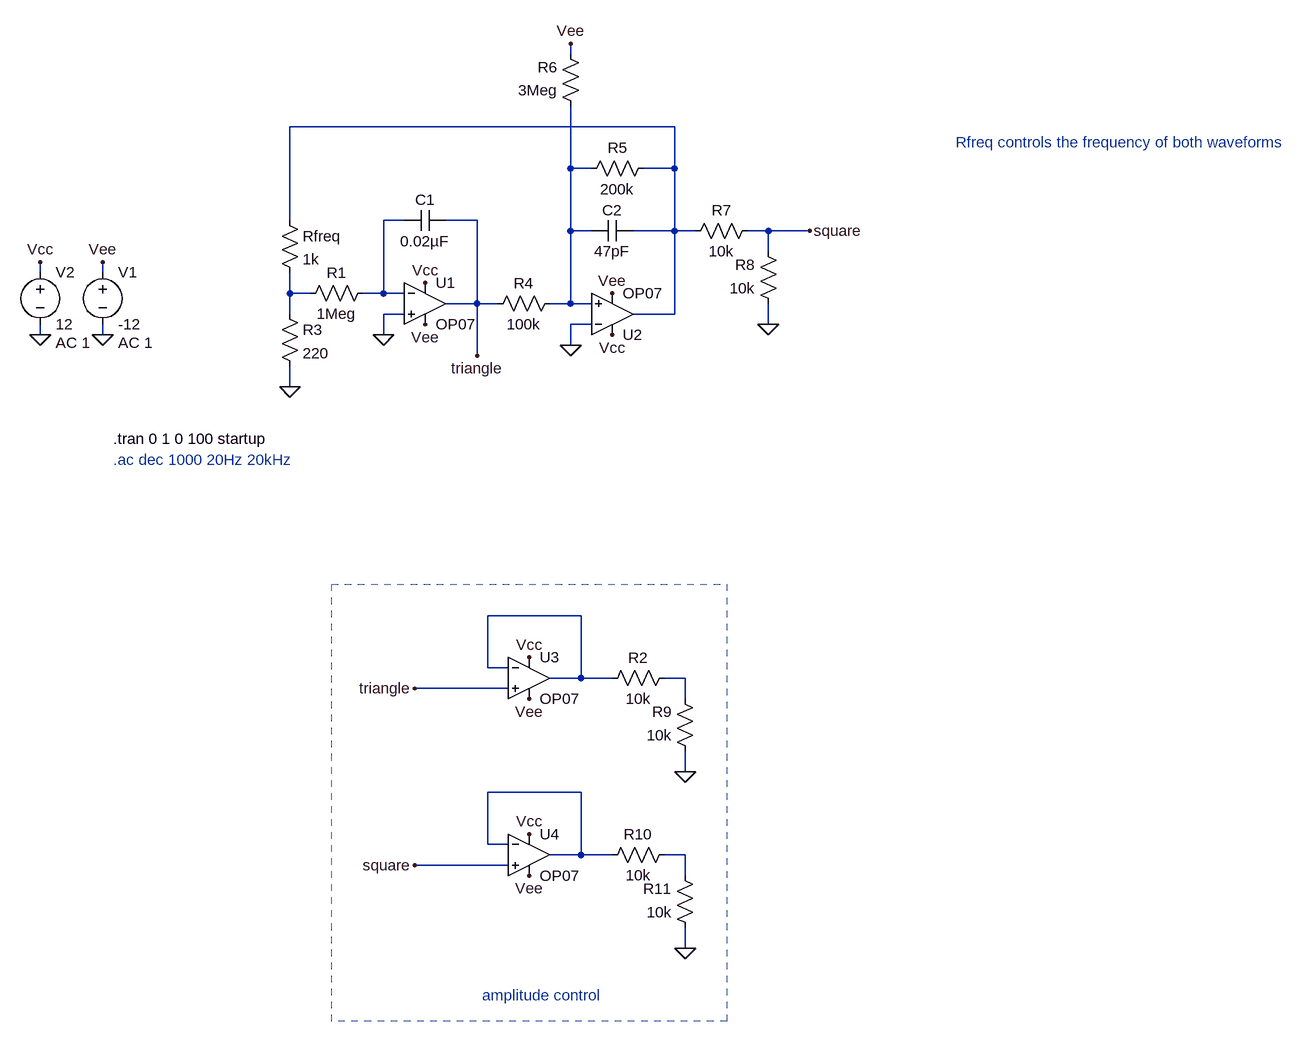
[diagram p0: schematic Draft1.asc]
Draft1.asc, the LTspice schematic file:
Version 4
SHEET 1 1568 1332
WIRE 416 -224 416 -240
WIRE 576 -112 -16 -112
WIRE 416 -48 416 -144
WIRE 448 -48 416 -48
WIRE 576 -48 576 -112
WIRE 576 -48 528 -48
WIRE -16 32 -16 -112
WIRE 160 32 128 32
WIRE 272 32 224 32
WIRE 416 48 416 -48
WIRE 448 48 416 48
WIRE 576 48 576 -48
WIRE 576 48 512 48
WIRE 608 48 576 48
WIRE 720 48 688 48
WIRE 784 48 720 48
WIRE 720 80 720 48
WIRE -400 112 -400 96
WIRE -304 112 -304 96
WIRE -16 144 -16 112
WIRE 16 144 -16 144
WIRE 128 144 128 32
WIRE 128 144 96 144
WIRE 160 144 128 144
WIRE 272 160 272 32
WIRE 272 160 224 160
WIRE 304 160 272 160
WIRE 416 160 416 48
WIRE 416 160 384 160
WIRE 448 160 416 160
WIRE -16 176 -16 144
WIRE 160 176 128 176
WIRE 576 176 576 48
WIRE 576 176 512 176
WIRE 448 192 416 192
WIRE 720 192 720 160
WIRE -400 208 -400 192
WIRE -304 208 -304 192
WIRE 128 208 128 176
WIRE 416 224 416 192
WIRE 272 240 272 160
WIRE -16 288 -16 256
WIRE 432 640 288 640
WIRE 288 720 288 640
WIRE 320 720 288 720
WIRE 432 736 432 640
WIRE 432 736 384 736
WIRE 480 736 432 736
WIRE 592 736 560 736
WIRE 320 752 176 752
WIRE 592 768 592 736
WIRE 592 880 592 848
WIRE 432 912 288 912
WIRE 288 992 288 912
WIRE 320 992 288 992
WIRE 432 1008 432 912
WIRE 432 1008 384 1008
WIRE 480 1008 432 1008
WIRE 592 1008 560 1008
WIRE 320 1024 176 1024
WIRE 592 1040 592 1008
WIRE 592 1152 592 1120
FLAG -304 208 0
FLAG -400 208 0
FLAG -400 96 Vcc
FLAG -304 96 Vee
FLAG 192 128 Vcc
FLAG 192 192 Vee
FLAG 128 208 0
FLAG -16 288 0
FLAG 480 144 Vee
FLAG 480 208 Vcc
FLAG 416 224 0
FLAG 720 192 0
FLAG 416 -240 Vee
FLAG 272 240 triangle
FLAG 784 48 square
FLAG 352 768 Vee
FLAG 352 704 Vcc
FLAG 176 752 triangle
FLAG 592 880 0
FLAG 352 1040 Vee
FLAG 352 976 Vcc
FLAG 176 1024 square
FLAG 592 1152 0
SYMBOL OpAmps\\OP07 192 96 R0
SYMATTR InstName U1
SYMBOL voltage -304 96 R0
WINDOW 123 24 124 Left 2
WINDOW 39 0 0 Left 0
SYMATTR Value2 AC 1
SYMATTR InstName V1
SYMATTR Value -12
SYMBOL voltage -400 96 R0
WINDOW 123 24 124 Left 2
WINDOW 39 0 0 Left 0
SYMATTR Value2 AC 1
SYMATTR InstName V2
SYMATTR Value 12
SYMBOL cap 224 16 R90
WINDOW 0 0 32 VBottom 2
WINDOW 3 32 32 VTop 2
SYMATTR InstName C1
SYMATTR Value 0.02µF
SYMBOL res 112 128 R90
WINDOW 0 0 56 VBottom 2
WINDOW 3 32 56 VTop 2
SYMATTR InstName R1
SYMATTR Value 1Meg
SYMBOL res -32 16 R0
SYMATTR InstName Rfreq
SYMATTR Value 1k
SYMBOL res -32 160 R0
SYMATTR InstName R3
SYMATTR Value 220
SYMBOL res 400 144 R90
WINDOW 0 0 56 VBottom 2
WINDOW 3 32 56 VTop 2
SYMATTR InstName R4
SYMATTR Value 100k
SYMBOL OpAmps\\OP07 480 240 M180
SYMATTR InstName U2
SYMBOL cap 512 32 R90
WINDOW 0 0 32 VBottom 2
WINDOW 3 32 32 VTop 2
SYMATTR InstName C2
SYMATTR Value 47pF
SYMBOL res 544 -64 R90
WINDOW 0 0 56 VBottom 2
WINDOW 3 32 56 VTop 2
SYMATTR InstName R5
SYMATTR Value 200k
SYMBOL res 432 -128 R180
WINDOW 0 36 76 Left 2
WINDOW 3 36 40 Left 2
SYMATTR InstName R6
SYMATTR Value 3Meg
SYMBOL res 704 32 R90
WINDOW 0 0 56 VBottom 2
WINDOW 3 32 56 VTop 2
SYMATTR InstName R7
SYMATTR Value 10k
SYMBOL res 736 176 R180
WINDOW 0 36 76 Left 2
WINDOW 3 36 40 Left 2
SYMATTR InstName R8
SYMATTR Value 10k
SYMBOL OpAmps\\OP07 352 672 R0
SYMATTR InstName U3
SYMBOL res 576 720 R90
WINDOW 0 0 56 VBottom 2
WINDOW 3 32 56 VTop 2
SYMATTR InstName R2
SYMATTR Value 10k
SYMBOL res 608 864 R180
WINDOW 0 36 76 Left 2
WINDOW 3 36 40 Left 2
SYMATTR InstName R9
SYMATTR Value 10k
SYMBOL OpAmps\\OP07 352 944 R0
SYMATTR InstName U4
SYMBOL res 576 992 R90
WINDOW 0 0 56 VBottom 2
WINDOW 3 32 56 VTop 2
SYMATTR InstName R10
SYMATTR Value 10k
SYMBOL res 608 1136 R180
WINDOW 0 36 76 Left 2
WINDOW 3 36 40 Left 2
SYMATTR InstName R11
SYMATTR Value 10k
TEXT -288 368 Left 2 !.tran 0 1 0 100 startup
TEXT 1008 -88 Left 2 ;Rfreq controls the frequency of both waveforms
TEXT -288 400 Left 2 ;.ac dec 1000 20Hz 20kHz
TEXT 280 1224 Left 2 ;amplitude control
RECTANGLE Normal 48 592 656 1264 2

The netlist it stands for:
* Draft1.asc
XU1 0 N003 Vcc Vee triangle LT1001  ; OP07, pins In+ In- V+ V- OUT
V1 Vee 0 -12 AC 1
V2 Vcc 0 12 AC 1
C1 triangle N003 0.02µF
R1 N003 N004 1Meg
Rfreq N001 N004 1k
R3 N004 0 220
R4 N002 triangle 100k
XU2 N002 0 Vcc Vee N001 LT1001  ; OP07, pins In+ In- V+ V- OUT
C2 N001 N002 47pF
R5 N001 N002 200k
R6 N002 Vee 3Meg
R7 square N001 10k
R8 0 square 10k
XU3 triangle N005 Vcc Vee N005 LT1001  ; OP07, pins In+ In- V+ V- OUT
R2 N006 N005 10k
R9 0 N006 10k
XU4 square N007 Vcc Vee N007 LT1001  ; OP07, pins In+ In- V+ V- OUT
R10 N008 N007 10k
R11 0 N008 10k
.tran 0 1 0 100 startup
* Rfreq controls the frequency of both waveforms
* .ac dec 1000 20Hz 20kHz
* amplitude control
.lib LTC.lib
.backanno
.end